# EasyEDA schematic PCB for Rocket_2020-11-22_00-35-45.json
TITLE: Rocket PCB 1; REV: 1.0; Date: 2020-11-22; Sheet: 1/1; Company: Robert Kirk
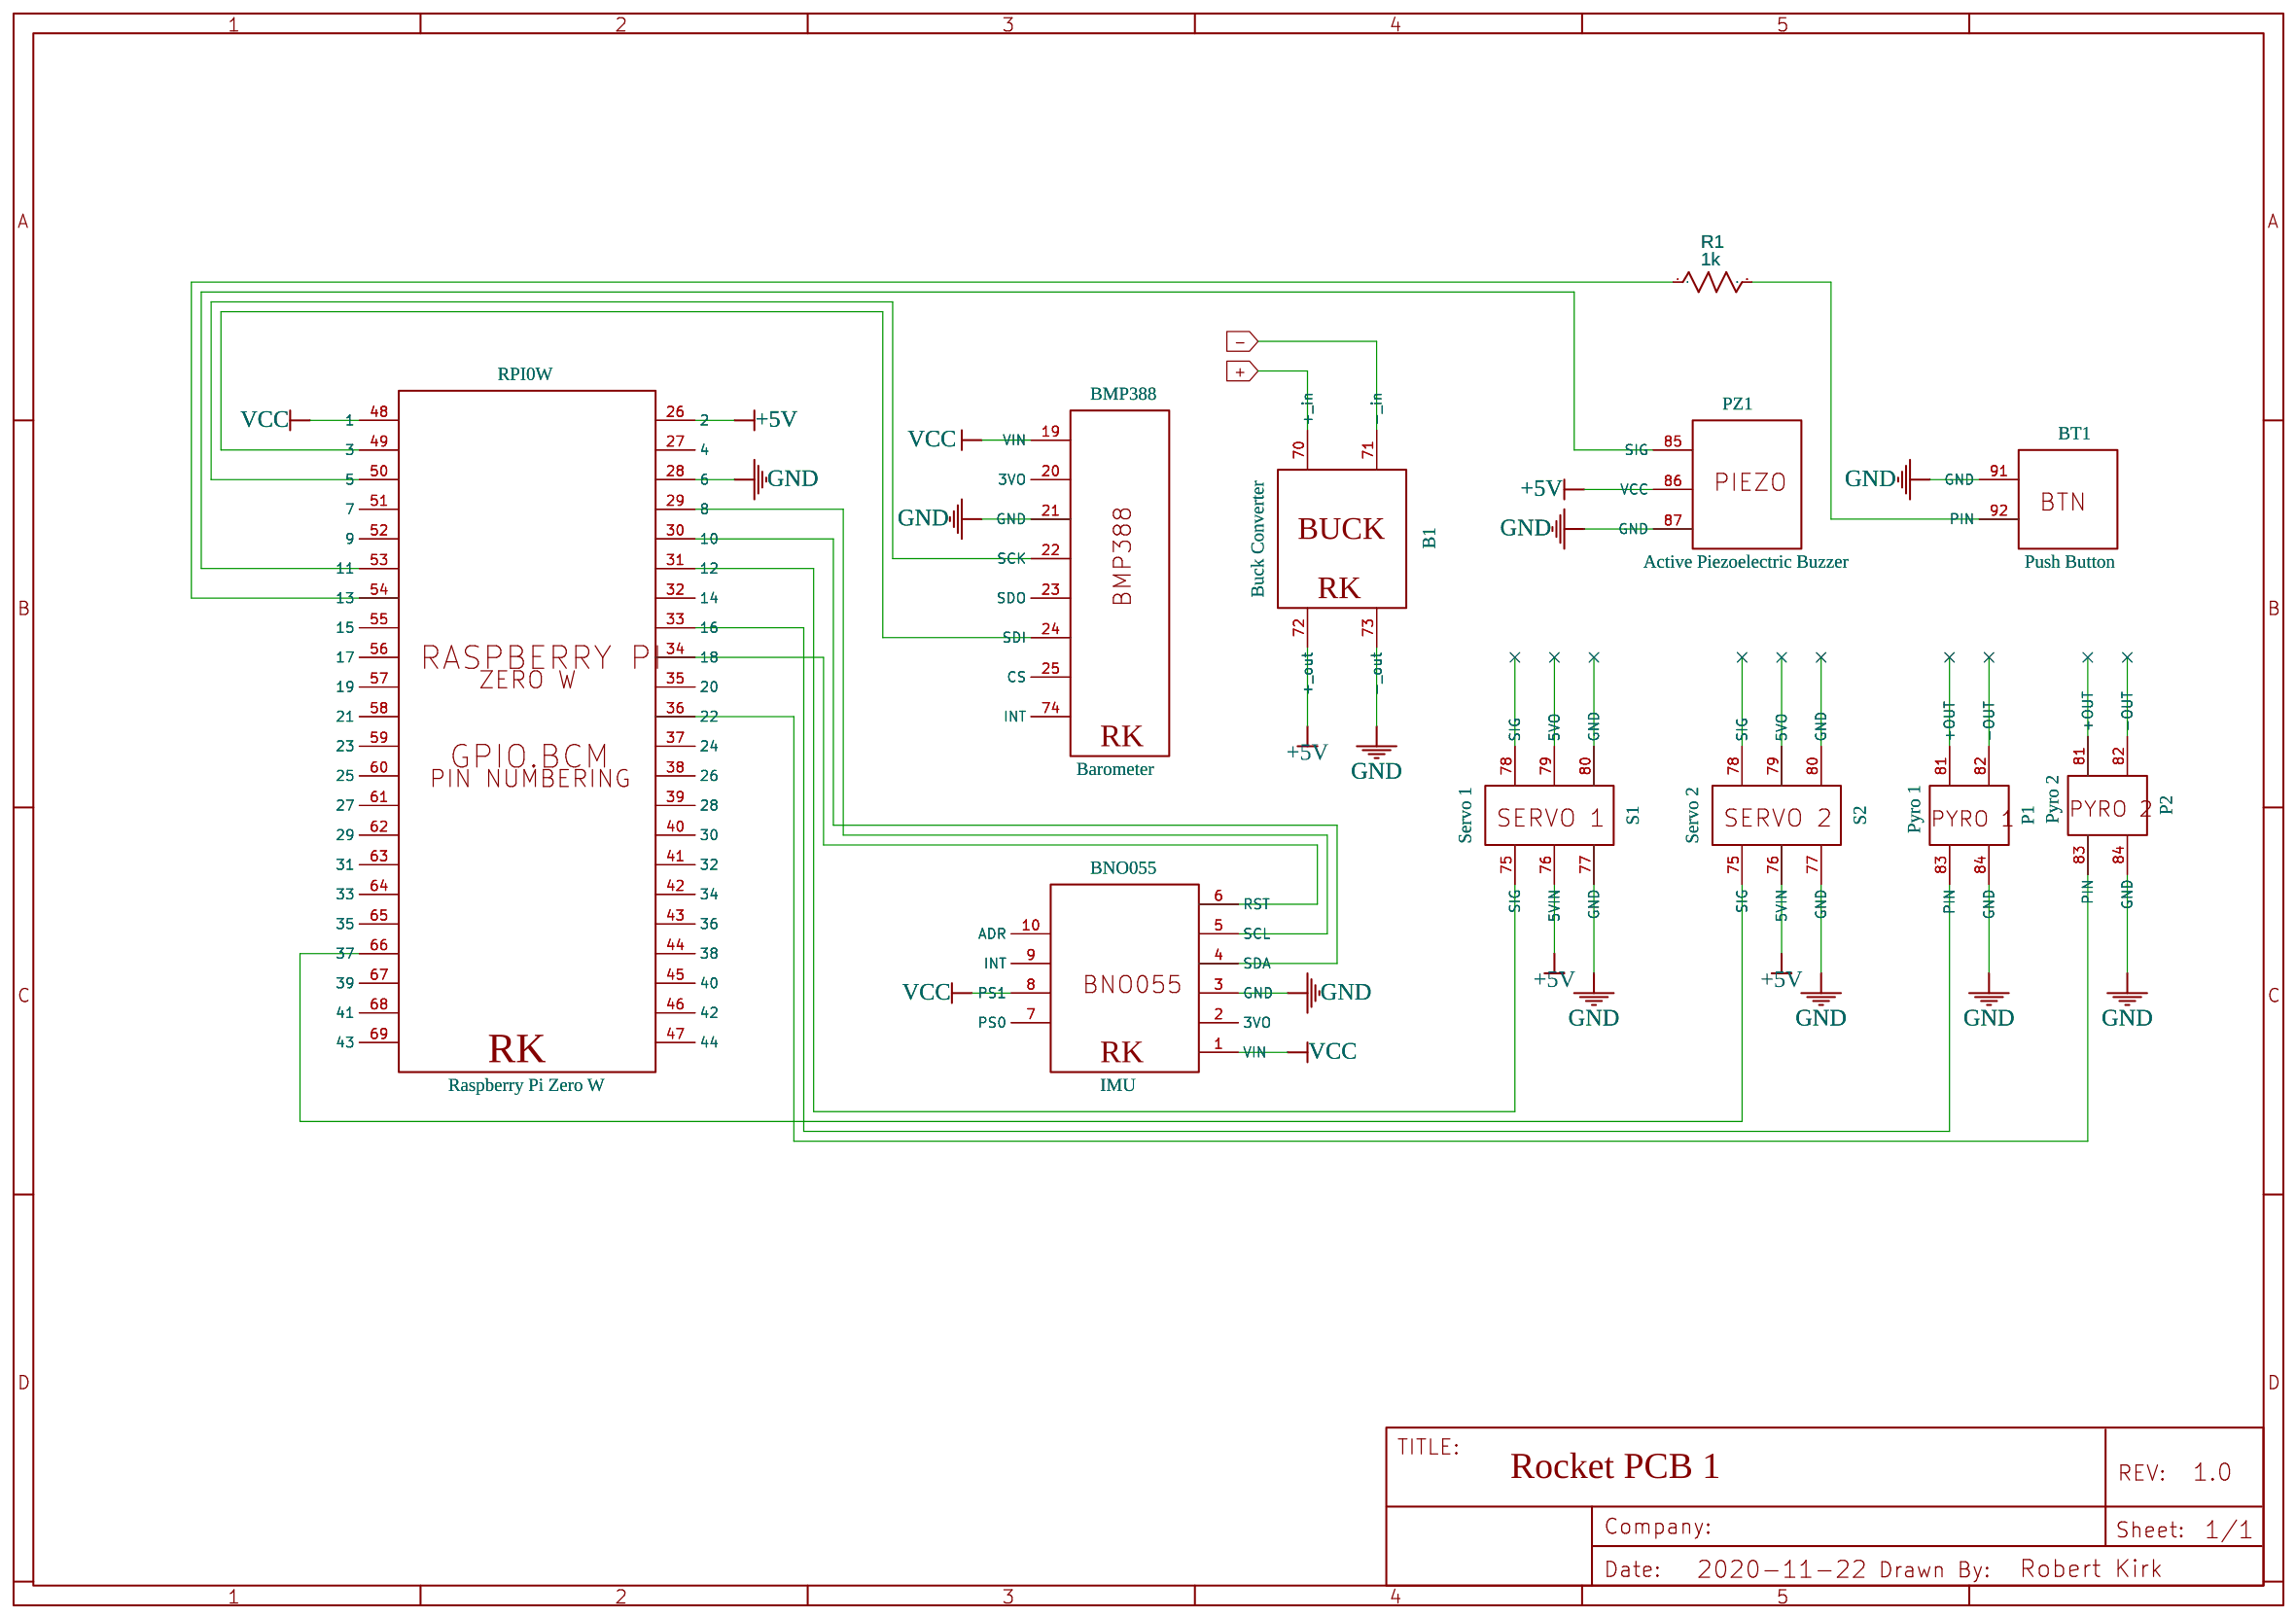
[diagram p0: schematic sheet]

## Parts
B1  Buck Converter
BMP388  Barometer
BNO055  IMU
BT1  Push Button
P1  Pyro 1
P2  Pyro 2
PZ1  Active Piezoelectric Buzzer
R1  1k  [R0603]
RPI0W  Raspberry Pi Zero W
S1  Servo 1
S2  Servo 2

## Library data of the parts
R1 = R_0603_US: Contributor: LCEDA_Lib

## Nets
+5V: B1.72(+ out) PZ1.86(VCC) RPI0W.26(2) S1.76(5VIN) S2.76(5VIN)
GND: B1.73(- out) BMP388.21(GND) BNO055.3(GND) BT1.91(GND) P1.84(GND) P2.84(GND) PZ1.87(GND) RPI0W.28(6) S1.77(GND) S2.77(GND)
VCC: BMP388.19(VIN) BNO055.1(VIN) BNO055.8(PS1) RPI0W.48(1)
+: B1.70(+ in)
-: B1.71(- in)
Net-(BMP388-22): BMP388.22(SCK) RPI0W.50(5)
Net-(BMP388-24): BMP388.24(SDI) RPI0W.49(3)
Net-(BNO055-4): BNO055.4(SDA) RPI0W.30(10)
Net-(BNO055-5): BNO055.5(SCL) RPI0W.29(8)
Net-(BNO055-6): BNO055.6(RST) RPI0W.34(18)
Net-(BT1-92): BT1.92(PIN) R1.2
Net-(P1-83): P1.83(PIN) RPI0W.33(16)
Net-(P2-83): P2.83(PIN) RPI0W.36(22)
Net-(PZ1-85): PZ1.85(SIG) RPI0W.53(11)
Net-(R1-1): R1.1 RPI0W.54(13)
Net-(RPI0W-31): RPI0W.31(12) S1.75(SIG)
Net-(RPI0W-66): RPI0W.66(37) S2.75(SIG)

Not connected (* = marked no-connect by the designer): BMP388 20(3VO) 23(SDO) 25(CS) 74(INT); BNO055 2(3VO) 7(PS0) 9(INT) 10(ADR); P1 81(+OUT) 82(-OUT); P2 81(+OUT) 82(-OUT); RPI0W 27(4) 32(14) 35(20) 37(24) 38(26) 39(28) 40(30) 41(32) 42(34) 43(36) 44(38) 45(40) 46(42) 47(44) 51(7) 52(9) 55(15) 56(17) 57(19) 58(21) 59(23) 60(25) 61(27) 62(29) 63(31) 64(33) 65(35) 67(39) 68(41) 69(43); S1 78(SIG) 79(5VO) 80(GND); S2 78(SIG) 79(5VO) 80(GND)
